# EAGLE schematic IdcProbe (EAGLE 7.1.0)
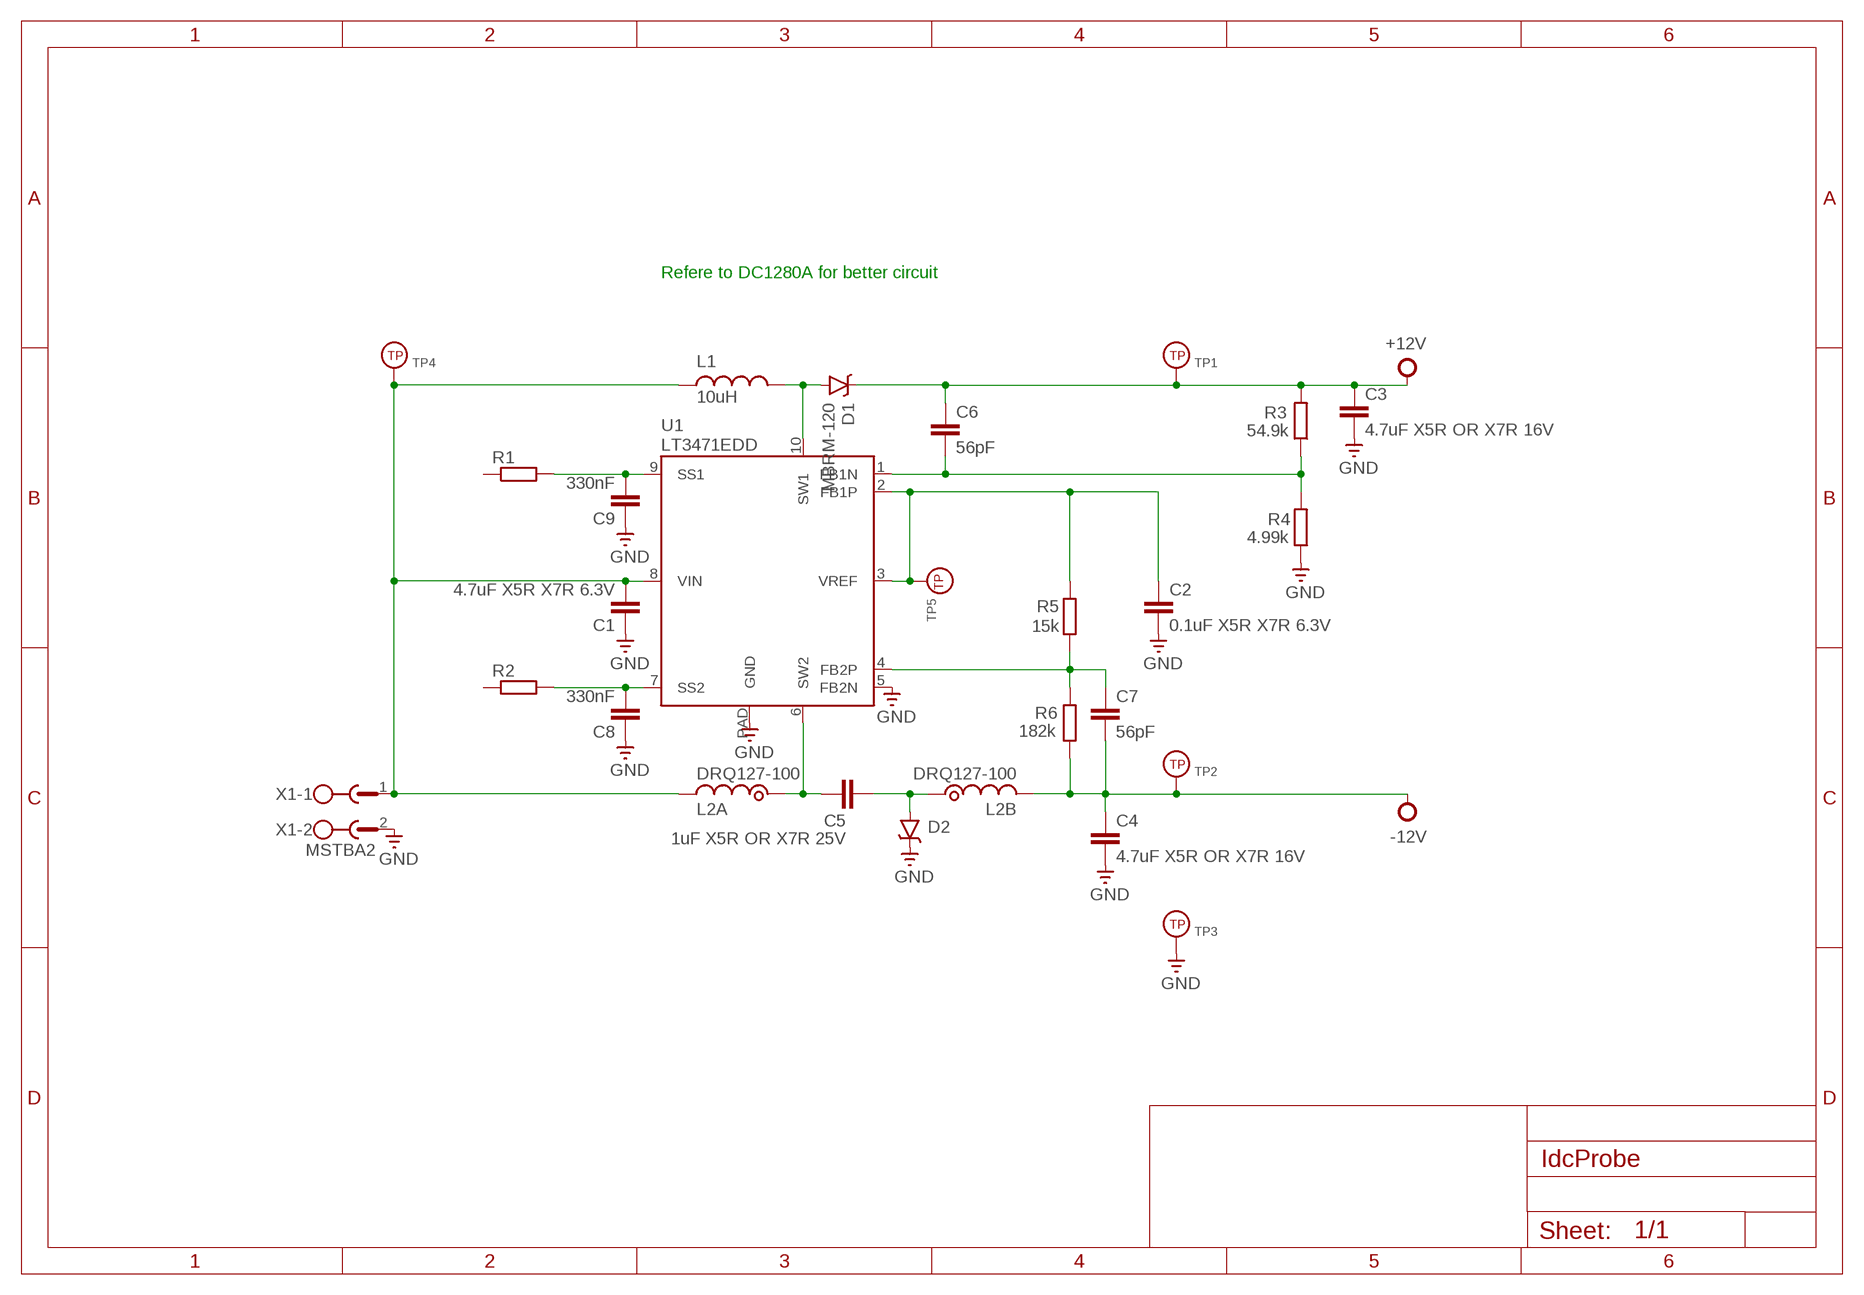
[diagram p0: schematic, sheet 1]

## Parts
C1  4.7uF X5R X7R 6.3V  C-EUC0603  [C0603]
C2  0.1uF X5R X7R 6.3V  C-EUC0603  [C0603]
C3  4.7uF X5R OR X7R 16V  C-EUC0603  [C0603]
C4  4.7uF X5R OR X7R 16V  C-EUC0603  [C0603]
C5  1uF X5R OR X7R 25V  C-EUC0603  [C0603]
C6  56pF  C-EUC0603  [C0603]
C7  56pF  C-EUC0603  [C0603]
C8  330nF  C-EUC0603  [C0603]
C9  330nF  C-EUC0603  [C0603]
D1  MBRM-120  DIODE-SCHOTTKY  [POWERMITE1]
D2  MBRM-120  DIODE-SCHOTTKY  [POWERMITE1]
L1  10uH  INDUCTOR  [242408FPS]
L2  DRQ127-100  TRANSFORMER_DRQ127  [DRQ127]
R1  R-EU_R0603  [R0603]
R2  R-EU_R0603  [R0603]
R3  54.9k  R-EU_R0603  [R0603]
R4  4.99k  R-EU_R0603  [R0603]
R5  15k  R-EU_R0603  [R0603]
R6  182k  R-EU_R0603  [R0603]
TP1  TESTPOINT  [TESTHOOK]
TP2  TESTPOINT  [TESTHOOK]
TP3  TESTPOINT  [TESTHOOK]
TP4  TESTPOINT  [TESTHOOK]
TP5  TESTPOINT  [TESTHOOK]
U1  LT3471EDD  [DFN10-3X3]
X1  MSTBA2  [MSTBA2]

## Nets
+12V: C3.1 C6.1 D1.1(C) R3.2 TP1.TP
-12V: C4.1 C7.2 L2.4 R6.1 TP2.TP
GND: C1.1 C2.2 C3.2 C4.2 C8.1 C9.1 D2.1(C) R4.1 TP3.TP U1.5(FB2N) U1.PAD(GND) X1.2
N$1: C9.2 R1.2 U1.9(SS1)
N$2: C8.2 R2.2 U1.7(SS2)
N$3: C1.2 L1.1 L2.3 TP4.TP U1.8(VIN) X1.1
N$4: D1.2(A) L1.2 U1.10(SW1)
N$6: C6.2 R3.1 R4.2 U1.1(FB1N)
N$8: C7.1 R5.2 R6.2 U1.4(FB2P)
N$10: C5.2 L2.1 U1.6(SW2)
N$12: C5.1 D2.2(A) L2.2
N$13: C2.1 R5.1 TP5.TP U1.2(FB1P) U1.3(VREF)
Unconnected: R1.1 R2.1

## Notes on the sheet
- Refere to DC1280A for better circuit

## Library data of the parts
C1-C9 = rcl:C-EU: CAPACITOR, European symbol
D1 D2 = Jeroen:DIODE-SCHOTTKY: Powermite diode based on MBRM120
L1 = Jeroen:INDUCTOR; MPN: 242408FPS‑220M‑01
L2 = Jeroen:TRANSFORMER_: Dual winding, shielded inductors/transformers
R1-R6 = rcl:R-EU_: RESISTOR, European symbol
TP1-TP5 = Jeroen:TESTPOINT
U1 = Jeroen:LT3471
X1 = con-phoenix-508:MSTBA2: PHOENIX; MF: FARNELL; MPN: 1757242; OC_FARNELL: 3705171; OC_NEWARK: 71C4161